# Altium project LCboardRev2.PrjPcb
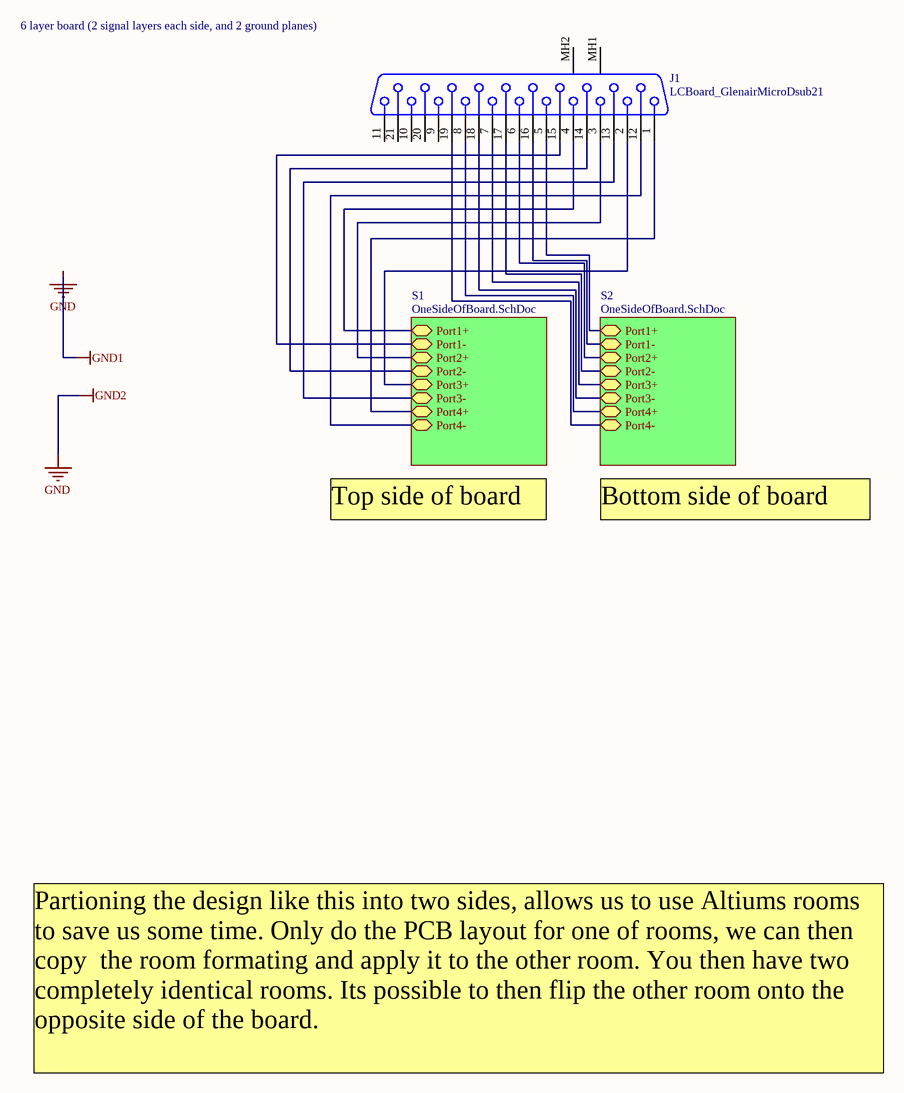
[diagram p0: LCboardRev2.SchDoc]
2 sheets, 117 parts. Net scope: hierarchical (ports join the sheet entries above them; power ports are global).
Board file: LCboardPCB.PcbDoc
Sheets:
  LCboardRev2.SchDoc
    S1 = OneSideOfBoard.SchDoc
    S2 = OneSideOfBoard.SchDoc

## Sheet LCboardRev2.SchDoc
size Letter

### Parts
J1  LCBoard_GlenairMicroDsub21  [MicroD-MWDM2L-21SCBRP-.110]

### Sub-sheets
S1 = OneSideOfBoard.SchDoc: Port1+, Port1-, Port2+, Port2-, Port3+, Port3-, Port4+, Port4-
S2 = OneSideOfBoard.SchDoc: Port1+, Port1-, Port2+, Port2-, Port3+, Port3-, Port4+, Port4-

### Nets
NetA4E_2: J1.2 ; sheet S1/Port3+
NetB4A_2: J1.1 ; sheet S1/Port4+
NetG4A_2: J1.8 ; sheet S2/Port4+
NetH4E_2: J1.7 ; sheet S2/Port3+
NetJ1_3: J1.3 ; sheet S1/Port2+
NetJ1_4: J1.4 ; sheet S1/Port1+
NetJ1_5: J1.5 ; sheet S2/Port1+
NetJ1_6: J1.6 ; sheet S2/Port2+
NetJ1_12: J1.12 ; sheet S1/Port4-
NetJ1_13: J1.13 ; sheet S1/Port3-
NetJ1_14: J1.14 ; sheet S1/Port2-
NetJ1_15: J1.15 ; sheet S1/Port1-
NetJ1_16: J1.16 ; sheet S2/Port1-
NetJ1_17: J1.17 ; sheet S2/Port2-
NetJ1_18: J1.18 ; sheet S2/Port3-
NetJ1_19: J1.19 ; sheet S2/Port4-

Not connected (* = marked no-connect by the designer): J1 9 10 11 20 21 MH1 MH2

### Notes on the sheet
- (near J1) 6 layer board (2 signal layers each side, and 2 ground planes)
- Top side of board
- Bottom side of board
- Partioning the design like this into two sides, allows us to use Altiums rooms to save us some time. Only do the PCB layout for one of rooms, we can then copy  the room formating and apply it to the other room. You then have two completely identical rooms. Its possible to then flip the other room onto the opposite side of the board.
- Labels drawn without touching a wire or pin: GND

### Library data of the parts
J1 = LCBoard_GlenairMicroDsub21: PackageDescription: Connector; D-Sub, Thru-Hole; 9 Position; Vertical; Body 30.81 x 9.60 x 8.20 mm (LxWxH)

## Sheet OneSideOfBoard.SchDoc
size Letter
Used 2 times, as channels S1, S2. Parts and nets are listed once, with the designators drawn on the sheet.
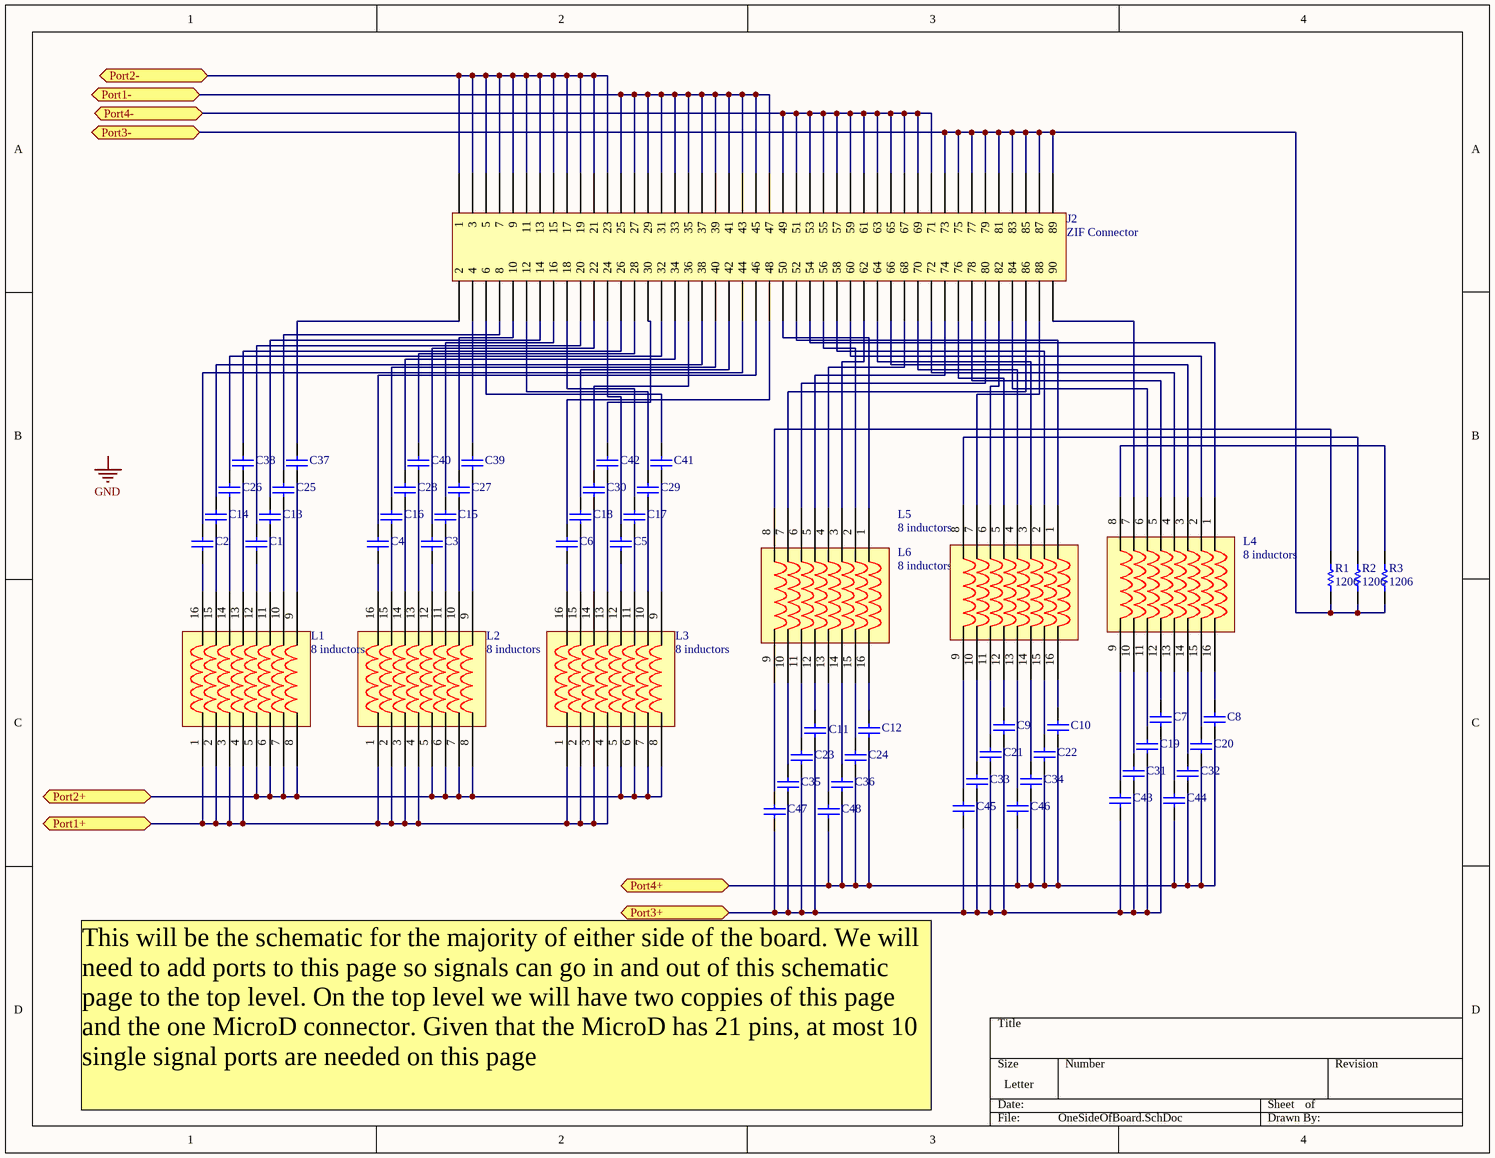
[diagram p1: OneSideOfBoard.SchDoc]

### Parts
C1  47nF  [CC3216-1206]  (value not drawn)
C2  47nF  [CC3216-1206]  (value not drawn)
C3  47nF  [CC3216-1206]  (value not drawn)
C4  47nF  [CC3216-1206]  (value not drawn)
C5  47nF  [CC3216-1206]  (value not drawn)
C6  47nF  [CC3216-1206]  (value not drawn)
C7  47nF  [CC3216-1206]  (value not drawn)
C8  47nF  [CC3216-1206]  (value not drawn)
C9  47nF  [CC3216-1206]  (value not drawn)
C10  47nF  [CC3216-1206]  (value not drawn)
C11  47nF  [CC3216-1206]  (value not drawn)
C12  47nF  [CC3216-1206]  (value not drawn)
C13  47nF  [CC3216-1206]  (value not drawn)
C14  47nF  [CC3216-1206]  (value not drawn)
C15  47nF  [CC3216-1206]  (value not drawn)
C16  47nF  [CC3216-1206]  (value not drawn)
C17  47nF  [CC3216-1206]  (value not drawn)
C18  47nF  [CC3216-1206]  (value not drawn)
C19  47nF  [CC3216-1206]  (value not drawn)
C20  47nF  [CC3216-1206]  (value not drawn)
C21  47nF  [CC3216-1206]  (value not drawn)
C22  47nF  [CC3216-1206]  (value not drawn)
C23  47nF  [CC3216-1206]  (value not drawn)
C24  47nF  [CC3216-1206]  (value not drawn)
C25  47nF  [CC3216-1206]  (value not drawn)
C26  47nF  [CC3216-1206]  (value not drawn)
C27  47nF  [CC3216-1206]  (value not drawn)
C28  47nF  [CC3216-1206]  (value not drawn)
C29  47nF  [CC3216-1206]  (value not drawn)
C30  47nF  [CC3216-1206]  (value not drawn)
C31  47nF  [CC3216-1206]  (value not drawn)
C32  47nF  [CC3216-1206]  (value not drawn)
C33  47nF  [CC3216-1206]  (value not drawn)
C34  47nF  [CC3216-1206]  (value not drawn)
C35  47nF  [CC3216-1206]  (value not drawn)
C36  47nF  [CC3216-1206]  (value not drawn)
C37  47nF  [CC3216-1206]  (value not drawn)
C38  47nF  [CC3216-1206]  (value not drawn)
C39  47nF  [CC3216-1206]  (value not drawn)
C40  47nF  [CC3216-1206]  (value not drawn)
C41  47nF  [CC3216-1206]  (value not drawn)
C42  47nF  [CC3216-1206]  (value not drawn)
C43  47nF  [CC3216-1206]  (value not drawn)
C44  47nF  [CC3216-1206]  (value not drawn)
C45  47nF  [CC3216-1206]  (value not drawn)
C46  47nF  [CC3216-1206]  (value not drawn)
C47  47nF  [CC3216-1206]  (value not drawn)
C48  47nF  [CC3216-1206]  (value not drawn)
J2  ZIF Connector  [LCBoard_ZIFCon]
L1  8 inductors  [LCboardInductor8]
L2  8 inductors  [LCboardInductor8]
L3  8 inductors  [LCboardInductor8]
L4  8 inductors  [LCboardInductor8]
L5  8 inductors  [LCboardInductor8]
L6  8 inductors  [LCboardInductor8]
R1  (no value)  [1206]
R2  (no value)  [1206]
R3  (no value)  [1206]

### Ports
Port1+, Port1-, Port2+, Port2-, Port3+, Port3-, Port4+, Port4-

### Nets
Port1+: L1.1 L1.2 L1.3 L1.4 L2.1 L2.2 L2.3 L2.4 L3.1 L3.2 L3.3 L3.4 ; port Port1+
Port1-: J2.25 J2.27 J2.29 J2.31 J2.33 J2.35 J2.37 J2.39 J2.41 J2.43 J2.45 J2.47 ; port Port1-
Port2+: L1.5 L1.6 L1.7 L1.8 L2.5 L2.6 L2.7 L2.8 L3.5 L3.6 L3.7 L3.8 ; port Port2+
Port2-: J2.1 J2.3 J2.5 J2.7 J2.9 J2.11 J2.13 J2.15 J2.17 J2.19 J2.21 J2.23 ; port Port2-
Port3+: C7.2 C9.2 C11.2 C19.2 C21.2 C23.2 C31.2 C33.2 C35.2 C43.2 C45.2 C47.2 ; port Port3+
Port3-: J2.73 J2.75 J2.77 J2.79 J2.81 J2.83 J2.85 J2.87 J2.89 R1.1 R2.1 R3.1 ; port Port3-
Port4+: C8.2 C10.2 C12.2 C20.2 C22.2 C24.2 C32.2 C34.2 C36.2 C44.2 C46.2 C48.2 ; port Port4+
Port4-: J2.49 J2.51 J2.53 J2.55 J2.57 J2.59 J2.61 J2.63 J2.65 J2.67 J2.69 J2.71 ; port Port4-
NetC1_1: C1.1 L1.12
NetC1_2: C1.2 J2.20
NetC2_1: C2.1 L1.16
NetC2_2: C2.2 J2.44
NetC3_1: C3.1 L2.12
NetC3_2: C3.2 J2.22
NetC4_1: C4.1 L2.16
NetC4_2: C4.2 J2.46
NetC5_1: C5.1 L3.12
NetC5_2: C5.2 J2.24
NetC6_1: C6.1 L3.16
NetC6_2: C6.2 J2.48
NetC7_1: C7.1 L4.12
NetC8_1: C8.1 L4.16
NetC9_1: C9.1 L5.12
NetC10_1: C10.1 L5.16
NetC11_1: C11.1 L6.12
NetC12_1: C12.1 L6.16
NetC13_1: C13.1 L1.11
NetC13_2: C13.2 J2.14
NetC14_1: C14.1 L1.15
NetC14_2: C14.2 J2.38
NetC15_1: C15.1 L2.11
NetC15_2: C15.2 J2.16
NetC16_1: C16.1 L2.15
NetC16_2: C16.2 J2.40
NetC17_1: C17.1 L3.11
NetC17_2: C17.2 J2.18
NetC18_1: C18.1 L3.15
NetC18_2: C18.2 J2.42
NetC19_1: C19.1 L4.11
NetC20_1: C20.1 L4.15
NetC21_1: C21.1 L5.11
NetC22_1: C22.1 L5.15
NetC23_1: C23.1 L6.11
NetC24_1: C24.1 L6.15
NetC25_1: C25.1 L1.10
NetC25_2: C25.2 J2.8
NetC26_1: C26.1 L1.14
NetC26_2: C26.2 J2.32
NetC27_1: C27.1 L2.10
NetC27_2: C27.2 J2.10
NetC28_1: C28.1 L2.14
NetC28_2: C28.2 J2.34
NetC29_1: C29.1 L3.10
NetC29_2: C29.2 J2.12
NetC30_1: C30.1 L3.14
NetC30_2: C30.2 J2.36
NetC31_1: C31.1 L4.10
NetC32_1: C32.1 L4.14
NetC33_1: C33.1 L5.10
NetC34_1: C34.1 L5.14
NetC35_1: C35.1 L6.10
NetC36_1: C36.1 L6.14
NetC37_1: C37.1 L1.9
NetC37_2: C37.2 J2.2
NetC38_1: C38.1 L1.13
NetC38_2: C38.2 J2.26
NetC39_1: C39.1 L2.9
NetC39_2: C39.2 J2.4
NetC40_1: C40.1 L2.13
NetC40_2: C40.2 J2.28
NetC41_1: C41.1 L3.9
NetC41_2: C41.2 J2.6
NetC42_1: C42.1 L3.13
NetC42_2: C42.2 J2.30
NetC43_1: C43.1 L4.9
NetC44_1: C44.1 L4.13
NetC45_1: C45.1 L5.9
NetC46_1: C46.1 L5.13
NetC47_1: C47.1 L6.9
NetC48_1: C48.1 L6.13
NetJ2_50: J2.50 L6.1
NetJ2_52: J2.52 L5.1
NetJ2_54: J2.54 L4.1
NetJ2_56: J2.56 L6.2
NetJ2_58: J2.58 L5.2
NetJ2_60: J2.60 L4.2
NetJ2_62: J2.62 L6.3
NetJ2_64: J2.64 L5.3
NetJ2_66: J2.66 L4.3
NetJ2_68: J2.68 L6.4
NetJ2_70: J2.70 L5.4
NetJ2_72: J2.72 L4.4
NetJ2_74: J2.74 L6.5
NetJ2_76: J2.76 L5.5
NetJ2_78: J2.78 L4.5
NetJ2_80: J2.80 L6.6
NetJ2_82: J2.82 L5.6
NetJ2_84: J2.84 L4.6
NetJ2_86: J2.86 L6.7
NetJ2_88: J2.88 L5.7
NetJ2_90: J2.90 L4.7
NetL4_8: L4.8 R3.2
NetL5_8: L5.8 R2.2
NetL6_8: L6.8 R1.2

### Channels
S1: designators C1=D1D C2=C1H C3=D2D C4=C2H C5=D3D C6=C3H C7=A4E C8=B4A C9=A5E C10=B5A C11=A6E C12=B6A C13=D1C C14=C1G C15=D2C C16=C2G C17=D3C C18=C3G C19=A4F C20=B4B C21=A5F C22=B5B C23=A6F C24=B6B C25=D1B C26=C1F C27=D2B C28=C2F C29=D3B C30=C3F C31=A4G C32=B4C C33=A5G C34=B5C C35=A6G C36=B6C C37=D1A C38=C1E C39=D2A C40=C2E C41=D3A C42=C3E C43=A4H C44=B4D C45=A5H C46=B5D C47=A6H C48=B6D J2=ZIF_S1 L1=L1_S1 L2=L2_S1 L3=L3_S1 L4=L4_S1 L5=L5_S1 L6=L6_S1 R1=R1#1 R2=R2#1 R3=R3#1; ports Port1+=NetJ1_4 Port1-=NetJ1_15 Port2+=NetJ1_3 Port2-=NetJ1_14 Port3+=NetA4E_2 Port3-=NetJ1_13 Port4+=NetB4A_2 Port4-=NetJ1_12
S2: designators C1=E1D C2=F1H C3=E2D C4=F2H C5=E3D C6=F3H C7=H4E C8=G4A C9=H5E C10=G5A C11=H6E C12=G6A C13=E1C C14=F1G C15=E2C C16=F2G C17=E3C C18=F3G C19=H4F C20=G4B C21=H5F C22=G5B C23=H6F C24=G6B C25=E1B C26=F1F C27=E2B C28=F2F C29=E3B C30=F3F C31=H4G C32=G4C C33=H5G C34=G5C C35=H6G C36=G6C C37=E1A C38=F1E C39=E2A C40=F2E C41=E3A C42=F3E C43=H4H C44=G4D C45=H5H C46=G5D C47=H6H C48=G6D J2=ZIF_S2 L1=L1_S2 L2=L2_S2 L3=L3_S2 L4=L4_S2 L5=L5_S2 L6=L6_S2 R1=R1#2 R2=R2#2 R3=R3#2; ports Port1+=NetJ1_5 Port1-=NetJ1_16 Port2+=NetJ1_6 Port2-=NetJ1_17 Port3+=NetH4E_2 Port3-=NetJ1_18 Port4+=NetG4A_2 Port4-=NetJ1_19

### Notes on the sheet
- This will be the schematic for the majority of either side of the board. We will need to add ports to this page so signals can go in and out of this schematic page to the top level. On the top level we will have two coppies of this page and the one MicroD connector. Given that the MicroD has 21 pins, at most 10 single signal ports are needed on this page
- Labels drawn without touching a wire or pin: GND

### Library data of the parts
C1-C48 = Cap Semi_1: Capacitor (Semiconductor SIM Model); Published: 8-Jun-2000; LatestRevisionDate: 17-Jul-2002; LatestRevisionNote: Re-released for DXP Platform.; PackageReference: C1206; Publisher: Altium Limited
J2 = LCboard_FH16-90S-0.3SHW(05)
L1-L6 = LCboardInductor8
R1-R3 = Res1206: Resistor; Param1: 100ppm/C; Value: DNL; Param: 1%; TechInfo: *

## Nets that join several sheets
NetA4E_2: LCboardRev2 (J1.2), S1 (12 pins)
NetB4A_2: LCboardRev2 (J1.1), S1 (12 pins)
NetG4A_2: LCboardRev2 (J1.8), S2 (12 pins)
NetH4E_2: LCboardRev2 (J1.7), S2 (12 pins)
NetJ1_3: LCboardRev2 (J1.3), S1 (12 pins)
NetJ1_4: LCboardRev2 (J1.4), S1 (12 pins)
NetJ1_5: LCboardRev2 (J1.5), S2 (12 pins)
NetJ1_6: LCboardRev2 (J1.6), S2 (12 pins)
NetJ1_12: LCboardRev2 (J1.12), S1 (12 pins)
NetJ1_13: LCboardRev2 (J1.13), S1 (12 pins)
NetJ1_14: LCboardRev2 (J1.14), S1 (12 pins)
NetJ1_15: LCboardRev2 (J1.15), S1 (12 pins)
NetJ1_16: LCboardRev2 (J1.16), S2 (12 pins)
NetJ1_17: LCboardRev2 (J1.17), S2 (12 pins)
NetJ1_18: LCboardRev2 (J1.18), S2 (12 pins)
NetJ1_19: LCboardRev2 (J1.19), S2 (12 pins)